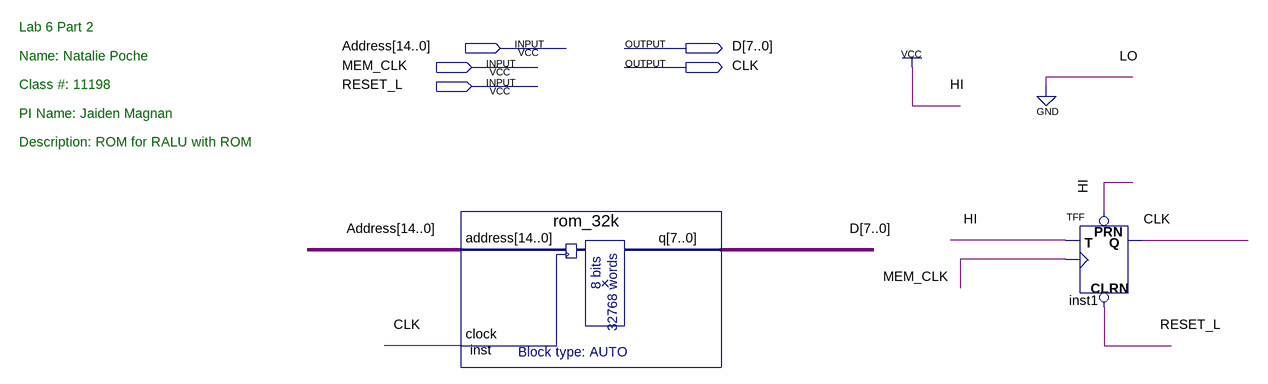
[diagram p0: schematic sheet]
// Quartus schematic ROM.bdf as structural Verilog: 2 symbols, 5 pins
module ROM (
  input  [14:0] Address,
  input  MEM_CLK,
  input  RESET_L,
  output [7:0] D,
  output CLK
);

  rom_32k inst (.address(Address), .clock(CLK), .q(D));
  TFF inst1 (.PRN(1'b1), .CLRN(RESET_L), .T(1'b1), .CLK(MEM_CLK), .Q(CLK));

  // Notes on the sheet:
  //   Lab 6 Part 2
  //   Name: Natalie Poche
  //   Class #: 11198
  //   PI Name: Jaiden Magnan
  //   Description: ROM for RALU with ROM
endmodule
